# EAGLE schematic voltage (EAGLE 9.6.2)
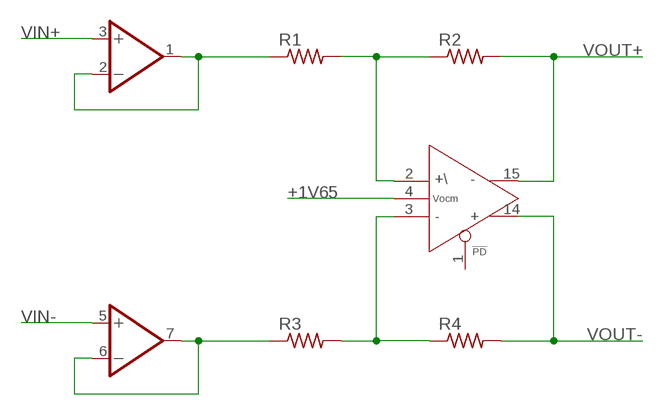
[diagram p0: schematic, sheet 1]

## Parts
R1  R-US_R0805  [R0805]
R2  R-US_R0805  [R0805]
R3  R-US_R0805  [R0805]
R4  R-US_R0805  [R0805]
U1  THS4532IPW  [SOP65P640X120-16N]
U2  MAX9944ATA+T  [21-0137_T833+2_MXM]

## Nets
+1V65: U1.4(A:VOCM)
N$1: R1.2 R2.1 U1.2(A:+IN)
N$2: R1.1 U2.1(A:OUT) U2.2(A:-IN)
N$3: R3.2 R4.1 U1.3(A:-IN)
N$4: R3.1 U2.6(B:-IN) U2.7(B:OUT)
VIN+: U2.3(A:+IN)
VIN-: U2.5(B:+IN)
VOUT+: R2.2 U1.15(A:OUT-)
VOUT-: R4.2 U1.14(A:OUT+)
Unconnected: U1.1(A:!PD) U1.5(B:!PD) U1.6(B:+IN) U1.7(B:-IN) U1.8(B:VOCM) U1.10(B:OUT+) U1.11(B:OUT-)

## Power pins joined to a net without a drawn wire
V+: U1.9(C:V+) U1.13(C:V+)
V-: U1.12(C:V-) U1.16(C:V-)
VCC: U2.8(C:VCC)
VEE: U2.4(C:VEE) U2.9(C:VEE)

## Library data of the parts
R1-R4 = rcl:R-US_: RESISTOR, American symbol; SPICEPREFIX: R
U1 = Soil Power Sensor:THS4532IPW; DESCRIPTION: Dual, Ultra low power 0.25mA, RRO, fully differential amplifier; DIGI-KEY_PART_NUMBER: 296-39813-5-ND; MF: Texas Instruments; MP: THS4532IPW; PACKAGE: TSSOP-16 Texas Instruments; PURCHASE-URL: https://pricing.snapeda.com/search/part/THS4532IPW/?ref=eda; SPICEPREFIX: X
U2 = Soil Power Sensor:MAX9944ATA+T: High-Voltage, Precision, Low-Power Op Amps; COPYRIGHT: Copyright (C) 2023 Ultra Librarian. All rights reserved.; MANUFACTURER_PART_NUMBER: MAX9944ATA+T; MFR_NAME: Analog Devices Inc